# EAGLE schematic clock-controller (EAGLE 7.5.0)
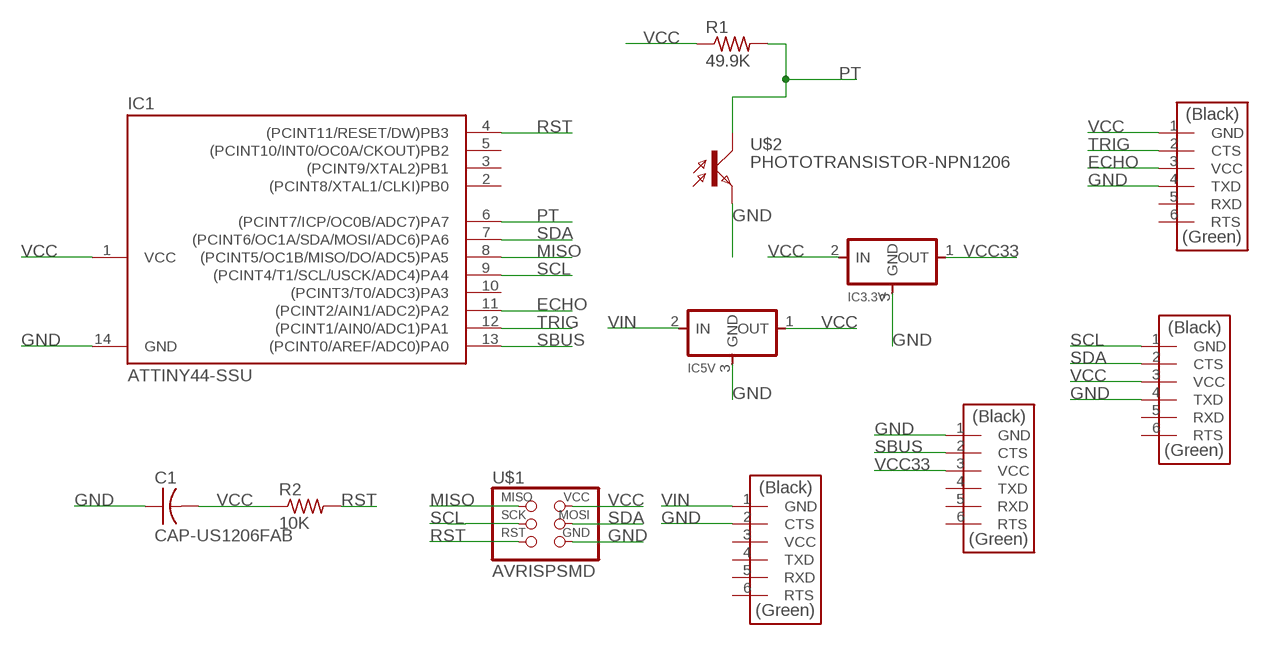
[diagram p0: schematic, sheet 1]

## Parts
C1  CAP-US1206FAB  [C1206FAB]
DIGITS  FTDI-SMD-HEADER  [1X06SMD]
IC1  ATTINY44-SSU  [SOIC14]
IC3.3V  REGULATORSOT23  [SOT23]
IC5V  REGULATORSOT23  [SOT23]
R1  49.9K  RES-US1206FAB  [R1206FAB]
R2  10K  RES-US1206FAB  [R1206FAB]
RTC  FTDI-SMD-HEADER  [1X06SMD]
U$1  AVRISPSMD  [2X03SMD]
U$2  PHOTOTRANSISTOR-NPN1206  [OP1206]
ULTRA  FTDI-SMD-HEADER  [1X06SMD]
USB  FTDI-SMD-HEADER  [1X06SMD]

## Nets
ECHO: IC1.11((PCINT2/AIN1/ADC2)PA2) ULTRA.3(VCC)
GND: C1.1 DIGITS.1(GND) IC1.14(GND) IC3.3V.3(GND) IC5V.3(GND) RTC.4(TXD) U$1.6(GND) U$2.EMITTER(E) ULTRA.4(TXD) USB.2(CTS)
MISO: IC1.8((PCINT5/OC1B/MISO/DO/ADC5)PA5) U$1.1(MISO)
PT: IC1.6((PCINT7/ICP/OC0B/ADC7)PA7) R1.2 U$2.COLLECTOR(C)
RST: IC1.4((PCINT11/RESET/DW)PB3) R2.2 U$1.5(RST)
SBUS: DIGITS.2(CTS) IC1.13((PCINT0/AREF/ADC0)PA0)
SCL: IC1.9((PCINT4/T1/SCL/USCK/ADC4)PA4) RTC.1(GND) U$1.3(SCK)
SDA: IC1.7((PCINT6/OC1A/SDA/MOSI/ADC6)PA6) RTC.2(CTS) U$1.4(MOSI)
TRIG: IC1.12((PCINT1/AIN0/ADC1)PA1) ULTRA.2(CTS)
VCC: C1.2 IC1.1(VCC) IC3.3V.2(IN) IC5V.1(OUT) R1.1 R2.1 RTC.3(VCC) U$1.2(VCC) ULTRA.1(GND)
VCC33: DIGITS.3(VCC) IC3.3V.1(OUT)
VIN: IC5V.2(IN) USB.1(GND)
Unconnected: DIGITS.4(TXD) DIGITS.5(RXD) DIGITS.6(RTS) IC1.2((PCINT8/XTAL1/CLKI)PB0) IC1.3((PCINT9/XTAL2)PB1) IC1.5((PCINT10/INT0/OC0A/CKOUT)PB2) IC1.10((PCINT3/T0/ADC3)PA3) RTC.5(RXD) RTC.6(RTS) ULTRA.5(RXD) ULTRA.6(RTS) USB.3(VCC) USB.4(TXD) USB.5(RXD) USB.6(RTS)

## Library data of the parts
C1 = fab:CAP-US
DIGITS RTC ULTRA USB = fab:FTDI-SMD-HEADER
IC1 = fab:ATTINY44
IC3.3V IC5V = fab:REGULATOR
R1 R2 = fab:RES-US: Resistor (US Symbol) Variants with postfix FAB are widened to allow the routing of internal traces
U$1 = fab:AVRISP
U$2 = fab:PHOTOTRANSISTOR-NPN

## Net classes
0 default: width 0.5 mm